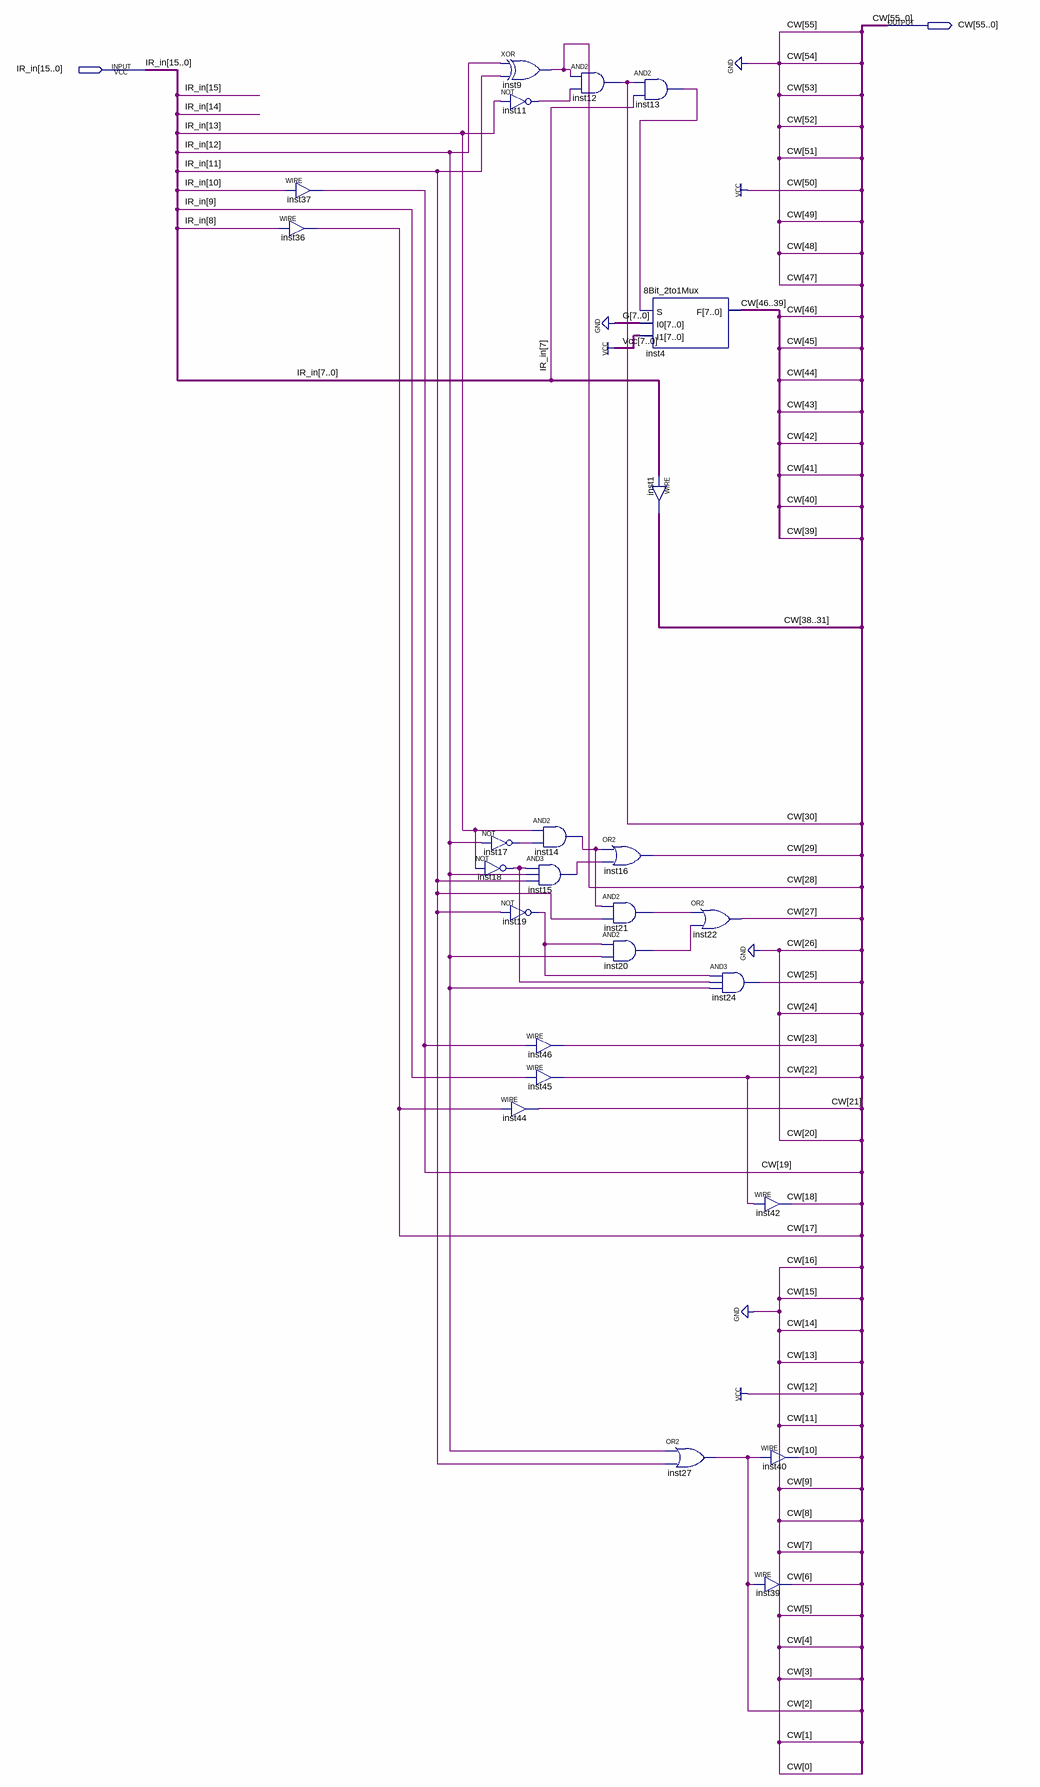
[diagram p0: schematic sheet]
// Quartus schematic Execute0_00.bdf as structural Verilog: 25 symbols, 2 pins
module Execute0_00 (
  input  [15:0] IR_in,
  output [55:0] CW
);

  wire inst11_out, inst13_out, inst14_out, inst15_out, inst17_out, inst18_out, inst19_out, inst20_out,
       inst21_out;

  assign CW[19] = IR_in[10];  // WIRE inst37
  assign CW[17] = IR_in[8];  // WIRE inst36
  xor inst9 (CW[28], IR_in[12], IR_in[11]);
  not inst11 (inst11_out, IR_in[13]);
  not inst17 (inst17_out, IR_in[12]);
  not inst18 (inst18_out, IR_in[13]);
  not inst19 (inst19_out, IR_in[11]);
  assign CW[21] = CW[17];  // WIRE inst44
  and inst14 (inst14_out, IR_in[13], inst17_out);
  and inst15 (inst15_out, inst18_out, IR_in[12], IR_in[11]);
  assign CW[23] = CW[19];  // WIRE inst46
  assign CW[22] = IR_in[9];  // WIRE inst45
  and inst12 (CW[30], CW[28], inst11_out);
  or inst16 (CW[29], inst14_out, inst15_out);
  and inst21 (inst21_out, inst14_out, IR_in[11]);
  and inst20 (inst20_out, inst19_out, IR_in[12]);
  and inst13 (inst13_out, CW[30], IR_in[7]);
  \8Bit_2to1Mux  inst4 (.S(inst13_out), .I0({8{1'b0}}), .I1({8{1'b1}}), .F(CW[46:39]));
  assign CW[38:31] = IR_in[7:0];  // WIRE inst1
  or inst27 (CW[2], IR_in[12], IR_in[11]);
  or inst22 (CW[27], inst21_out, inst20_out);
  and inst24 (CW[25], inst19_out, inst18_out, IR_in[12]);
  assign CW[18] = CW[22];  // WIRE inst42
  assign CW[10] = CW[2];  // WIRE inst40
  assign CW[6] = CW[2];  // WIRE inst39

  assign {CW[55:47], CW[26], CW[24], CW[20], CW[16:11], CW[9:7], CW[5:3], CW[1:0]} = 26'b00000100000000001000000000;
endmodule
